# Altium schematic sheet FULL_CB_INTEL_REV_D.SchDoc
size A4; DrawnBy: Philip Rowse

## Notes on the sheet
- Title:
- Date:
- Time:
- https://creativecommons.org/publicdomain/zero/1.0/
- Sheet:
- Approved:
- of:
- Drawn By:
- Checked By:
- ProfiCNC